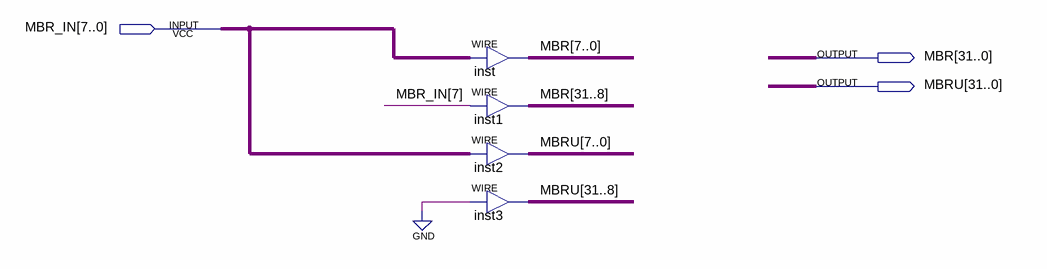
[diagram p0: schematic sheet]
// Quartus schematic mbr_extension.bdf as structural Verilog: 4 symbols, 3 pins
module mbr_extension (
  input  [7:0] MBR_IN,
  output [31:0] MBR,
  output [31:0] MBRU
);

  assign MBR[7:0] = MBR_IN;  // WIRE inst
  assign MBR[31:8] = {24{MBR_IN[7]}};  // WIRE inst1
  assign MBRU[7:0] = MBR_IN;  // WIRE inst2
  assign MBRU[31:8] = {24{1'b0}};  // WIRE inst3
endmodule
